# Altium schematic sheet 4.0寸_TK040及31pin.SchDoc
size A4
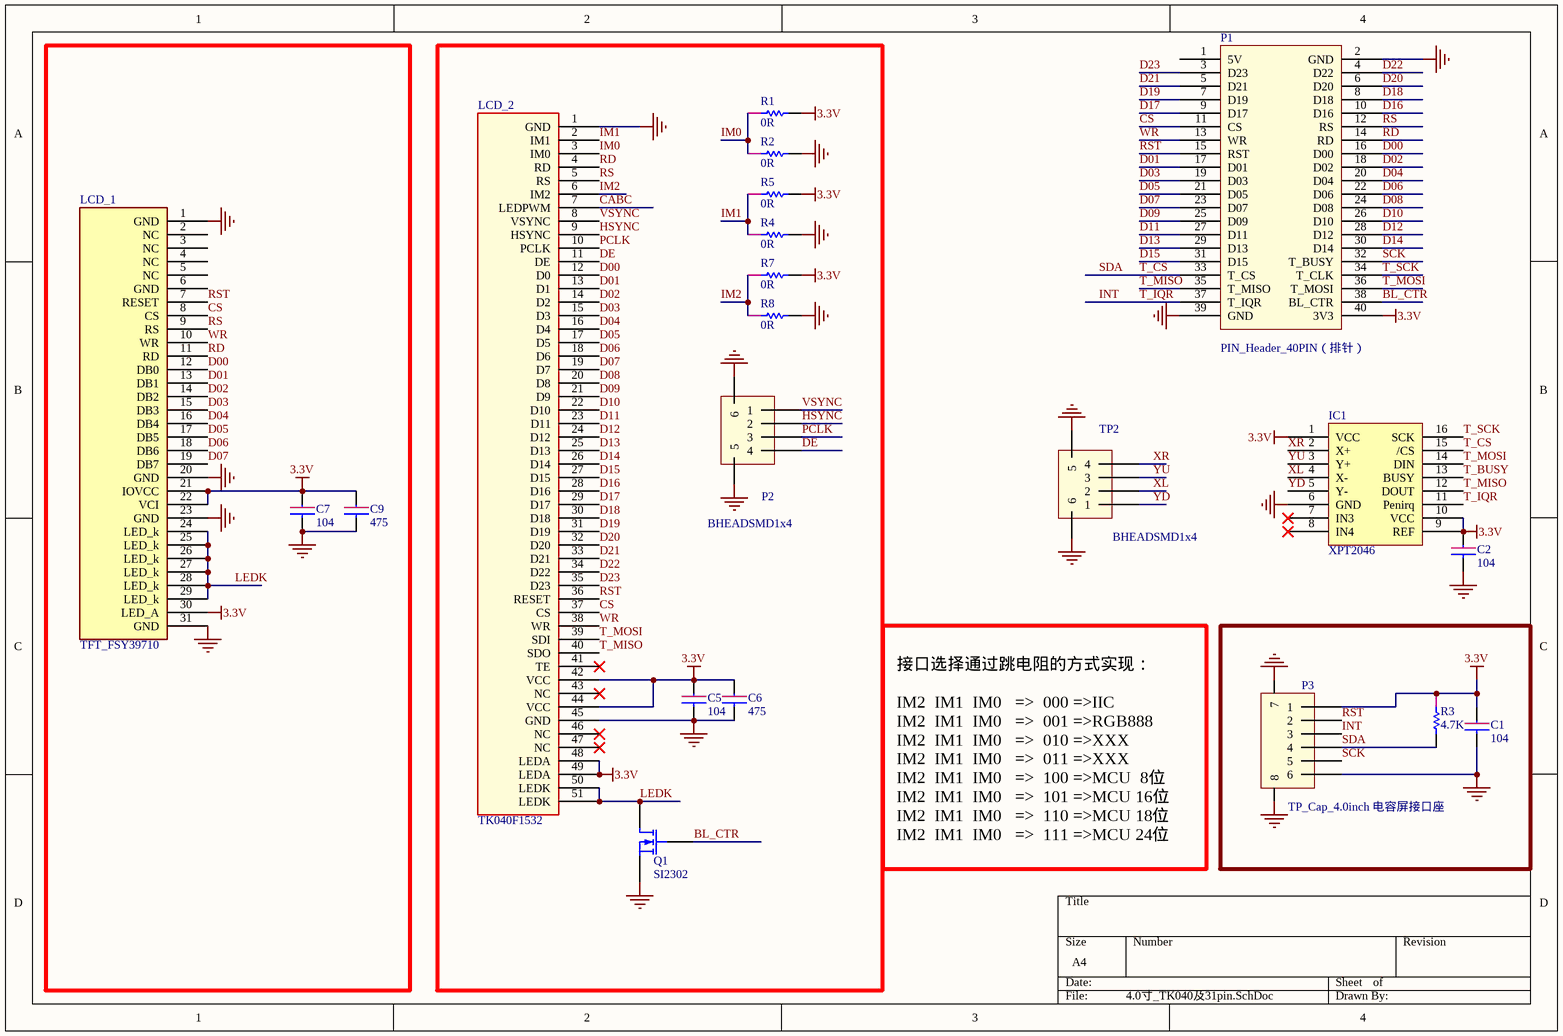
[diagram p0: 4.0寸_TK040及31pin.SchDoc]

## Parts
C1  104  [C0603-1]
C2  104  [C0603-2]
C5  104  [C0603-1]
C6  475  [C0603-2]
C7  104  [C0603-1]
C9  475  [C0603-1]
IC1  XPT2046  [SOT403-1]
LCD_1  TFT_FSY39710  [TFT_FSY39710]
LCD_2  TK040F1532  [TK040F1532]
P1  PIN_Header_40PIN（排针）  [P_Head_2x20]
P2  BHEADSMD1x4  [BHEADSMD1x4]
P3  TP_Cap_4.0inch 电容屏接口座  [TP_Cap_4.0inch]
Q1  SI2302  [SOT23A]
R1  0R  [R0603]
R2  0R  [R0603]
R3  4.7K  [R0603]
R4  0R  [R0603]
R5  0R  [R0603]
R7  0R  [R0603]
R8  0R  [R0603]
TP2  BHEADSMD1x4  [TP_4.0inch]

## Nets
3.3V: C1.1 C2.1 C5.1 C6.1 C7.1 C9.1 IC1.1(VCC) IC1.9(REF) IC1.10(VCC) LCD_1.21(IOVCC) LCD_1.22(VCI) LCD_1.30(LED_A) LCD_2.42(VCC) LCD_2.44(VCC) LCD_2.48(LEDA) LCD_2.49(LEDA) P1.40(3V3) P3.1 R1.2 R3.1 R5.2 R7.2
GND: C1.2 C2.2 C5.2 C6.2 C7.2 C9.2 IC1.6(GND) LCD_1.1(GND) LCD_1.20(GND) LCD_1.23(GND) LCD_1.31(GND) LCD_2.1(GND) LCD_2.45(GND) P1.2(GND) P1.39(GND) P2.5 P2.6 P3.6 P3.7 P3.8 Q1.2(S) R2.2 R4.2 R8.2 TP2.5 TP2.6
BL_CTR: P1.38(BL_CTR) Q1.1(G)
CABC: LCD_2.7(LEDPWM)
CS: LCD_1.8(CS) LCD_2.37(CS) P1.11(CS)
D00: LCD_1.12(DB0) LCD_2.12(D0) P1.16(D00)
D01: LCD_1.13(DB1) LCD_2.13(D1) P1.17(D01)
D02: LCD_1.14(DB2) LCD_2.14(D2) P1.18(D02)
D03: LCD_1.15(DB3) LCD_2.15(D3) P1.19(D03)
D04: LCD_1.16(DB4) LCD_2.16(D4) P1.20(D04)
D05: LCD_1.17(DB5) LCD_2.17(D5) P1.21(D05)
D06: LCD_1.18(DB6) LCD_2.18(D6) P1.22(D06)
D07: LCD_1.19(DB7) LCD_2.19(D7) P1.23(D07)
D08: LCD_2.20(D8) P1.24(D08)
D09: LCD_2.21(D9) P1.25(D09)
D10: LCD_2.22(D10) P1.26(D10)
D11: LCD_2.23(D11) P1.27(D11)
D12: LCD_2.24(D12) P1.28(D12)
D13: LCD_2.25(D13) P1.29(D13)
D14: LCD_2.26(D14) P1.30(D14)
D15: LCD_2.27(D15) P1.31(D15)
D16: LCD_2.28(D16) P1.10(D16)
D17: LCD_2.29(D17) P1.9(D17)
D18: LCD_2.30(D18) P1.8(D18)
D19: LCD_2.31(D19) P1.7(D19)
D20: LCD_2.32(D20) P1.6(D20)
D21: LCD_2.33(D21) P1.5(D21)
D22: LCD_2.34(D22) P1.4(D22)
D23: LCD_2.35(D23) P1.3(D23)
DE: LCD_2.11(DE) P2.4
HSYNC: LCD_2.9(HSYNC) P2.2
IM0: LCD_2.3(IM0) R1.1 R2.1
IM1: LCD_2.2(IM1) R4.1 R5.1
IM2: LCD_2.6(IM2) R7.1 R8.1
INT: IC1.11(Penirq) P1.37(T_IQR) P3.3  [also labelled T_IQR]
LEDK: LCD_1.24(LED_k) LCD_1.25(LED_k) LCD_1.26(LED_k) LCD_1.27(LED_k) LCD_1.28(LED_k) LCD_1.29(LED_k) LCD_2.50(LEDK) LCD_2.51(LEDK) Q1.3(D)
PCLK: LCD_2.10(PCLK) P2.3
RD: LCD_1.11(RD) LCD_2.4(RD) P1.14(RD)
RS: LCD_1.9(RS) LCD_2.5(RS) P1.12(RS)
RST: LCD_1.7(RESET) LCD_2.36(RESET) P1.15(RST) P3.2
SCK: P1.32(T_BUSY) P3.5
SDA: IC1.15(/CS) P1.33(T_CS) P3.4 R3.2  [also labelled T_CS]
T_BUSY: IC1.13(BUSY)
T_MISO: IC1.12(DOUT) LCD_2.40(SDO) P1.35(T_MISO)
T_MOSI: IC1.14(DIN) LCD_2.39(SDI) P1.36(T_MOSI)
T_SCK: IC1.16(SCK) P1.34(T_CLK)
VSYNC: LCD_2.8(VSYNC) P2.1
WR: LCD_1.10(WR) LCD_2.38(WR) P1.13(WR)
XL: IC1.4(X-) TP2.2
XR: IC1.2(X+) TP2.4
YD: IC1.5(Y-) TP2.1
YU: IC1.3(Y+) TP2.3

Not connected (* = marked no-connect by the designer): IC1 7(IN3)* 8(IN4)*; LCD_1 2(NC) 3(NC) 4(NC) 5(NC) 6(GND); LCD_2 41(TE)* 43(NC)* 46(NC)* 47(NC)*; P1 1(5V)

## Notes on the sheet
- 接口选择通过跳电阻的方式实现：
  IM2  IM1  IM0   =>  000 =>IIC
  IM2  IM1  IM0   =>  001 =>RGB888
  IM2  IM1  IM0   =>  010 =>XXX
  IM2  IM1  IM0   =>  011 =>XXX
  IM2  IM1  IM0   =>  100 =>MCU  8位
  IM2  IM1  IM0   =>  101 =>MCU 16位
  IM2  IM1  IM0   =>  110 =>MCU 18位
  IM2  IM1  IM0   =>  111 =>MCU 24位

## Library data of the parts
C1 C2 C5-C7 C9 = cap
IC1 = ADS7843
P1 = PIN_Header_40PIN
P3 = BHEADSMD1x6
Q1 = MOSFET-N
R1-R5 R7 R8 = Resistor